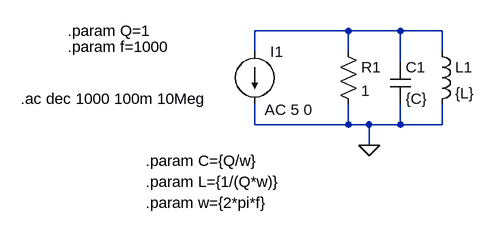
[diagram p0: schematic RLC paralelo.asc]
RLC paralelo.asc, the LTspice schematic file:
Version 4
SHEET 1 880 680
WIRE 192 96 48 96
WIRE 272 96 192 96
WIRE 336 96 272 96
WIRE 48 128 48 96
WIRE 192 128 192 96
WIRE 336 128 336 96
WIRE 272 144 272 96
WIRE 48 240 48 208
WIRE 192 240 192 208
WIRE 192 240 48 240
WIRE 224 240 192 240
WIRE 272 240 272 208
WIRE 272 240 224 240
WIRE 336 240 336 208
WIRE 336 240 272 240
WIRE 224 272 224 240
FLAG 224 272 0
SYMBOL res 176 112 R0
SYMATTR InstName R1
SYMATTR Value 1
SYMBOL cap 256 144 R0
SYMATTR InstName C1
SYMATTR Value {C}
SYMBOL ind 320 112 R0
SYMATTR InstName L1
SYMATTR Value {L}
SYMBOL current 48 128 R0
WINDOW 123 15 89 Left 2
WINDOW 39 0 0 Left 0
SYMATTR InstName I1
SYMATTR Value ""
SYMATTR Value2 AC 5 0
TEXT -120 296 Left 2 !.param C={Q/w}
TEXT -120 328 Left 2 !.param L={1/(Q*w)}
TEXT -120 360 Left 2 !.param w={2*pi*f}
TEXT -240 96 Left 2 !.param Q=1
TEXT -240 120 Left 2 !.param f=1000
TEXT -312 200 Left 2 !.ac dec 1000 100m 10Meg

The netlist it stands for:
* RLC paralelo.asc
R1 N001 0 1
C1 N001 0 {C}
L1 N001 0 {L}
I1 N001 0 AC 5 0
.param C={Q/w}
.param L={1/(Q*w)}
.param w={2*pi*f}
.param Q=1
.param f=1000
.ac dec 1000 100m 10Meg
.backanno
.end